# Altium schematic sheet Peripherals_Sheet.SchDoc
size A4; SheetNumber: 2; SheetTotal: 2
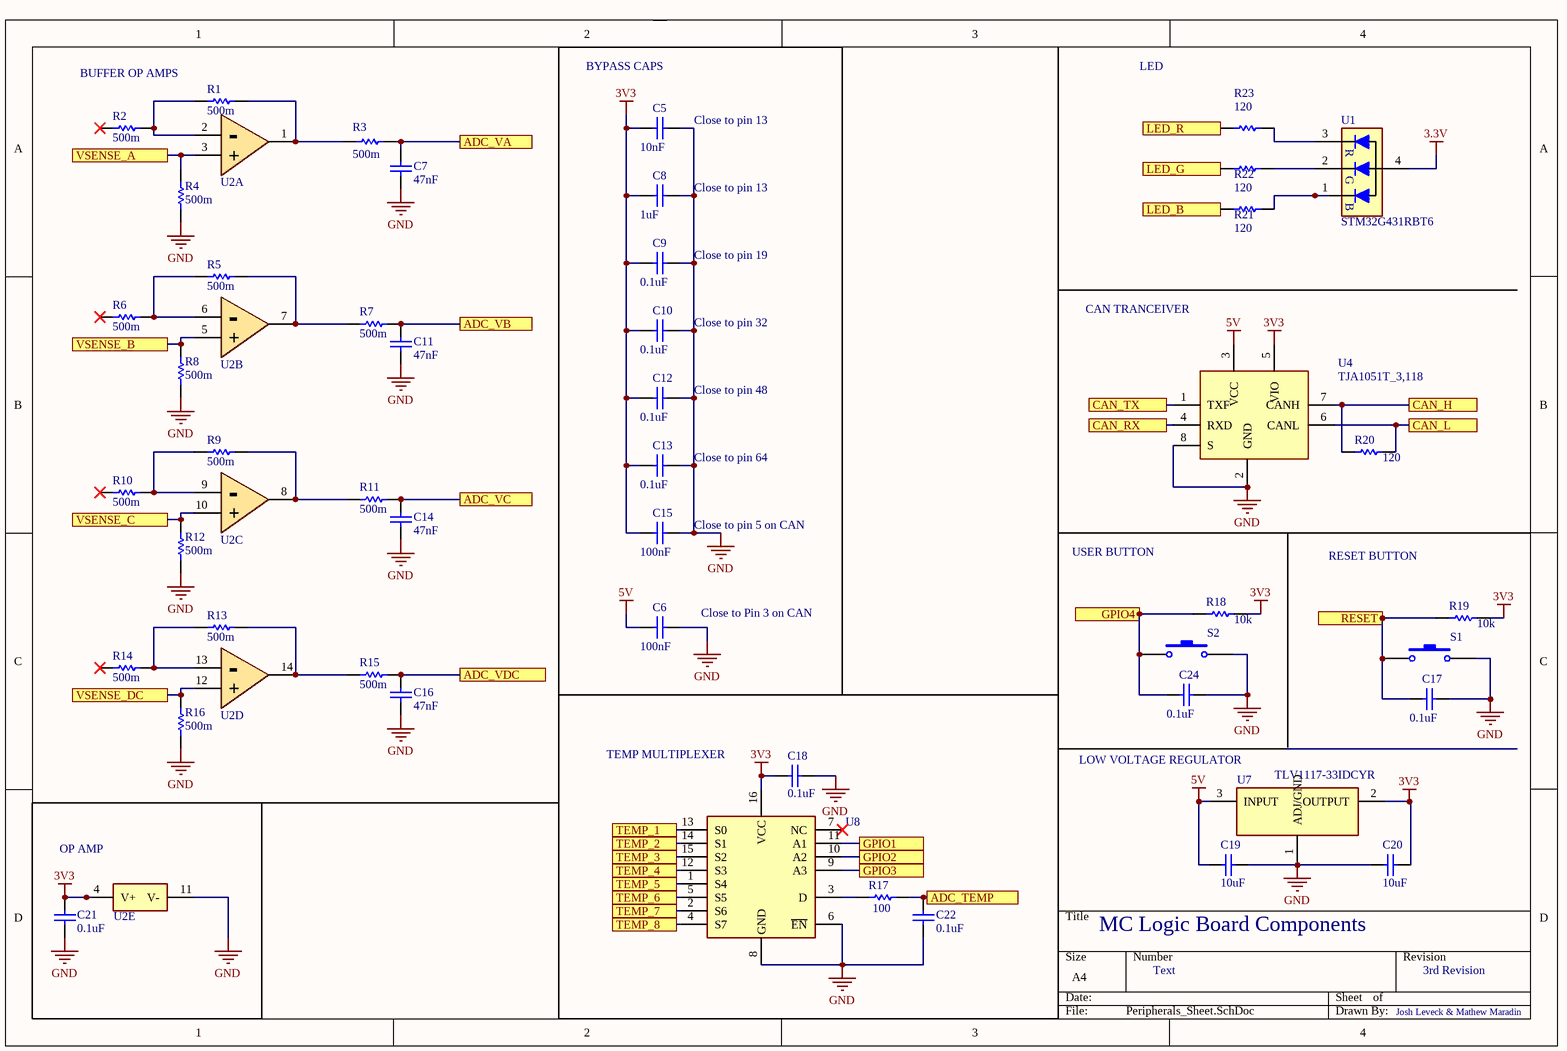
[diagram p0: Peripherals_Sheet.SchDoc]

## Parts
C5  value 10nF  [0805 - Capacitor]  (hidden comment: 10V)
C6  value 100nF  [0805 - Capacitor]  (hidden comment: Capacitor - Nonpolarized)
C7  value 47nF  [0805 - Capacitor]  (hidden comment: Capacitor - Nonpolarized)
C8  value 1uF  [0805 - Capacitor]  (hidden comment: 100V)
C9  value 0.1uF  [0805 - Capacitor]  (hidden comment: 100V)
C10  value 0.1uF  [0805 - Capacitor]  (hidden comment: 100V)
C11  value 47nF  [0805 - Capacitor]  (hidden comment: Capacitor - Nonpolarized)
C12  value 0.1uF  [0805 - Capacitor]  (hidden comment: 100V)
C13  value 0.1uF  [0805 - Capacitor]  (hidden comment: 100V)
C14  value 47nF  [0805 - Capacitor]  (hidden comment: Capacitor - Nonpolarized)
C15  value 100nF  [0805 - Capacitor]  (hidden comment: Capacitor - Nonpolarized)
C16  value 47nF  [0805 - Capacitor]  (hidden comment: Capacitor - Nonpolarized)
C17  value 0.1uF  [0805 - Capacitor]  (hidden comment: 100V)
C18  value 0.1uF  [0805 - Capacitor]  (hidden comment: Capacitor - Nonpolarized)
C19  value 10uF  [0805 - Capacitor]  (hidden comment: Capacitor - Nonpolarized)
C20  value 10uF  [0805 - Capacitor]  (hidden comment: Capacitor - Nonpolarized)
C21  value 0.1uF  [0805 - Capacitor]  (hidden comment: Capacitor - Nonpolarized)
C22  value 0.1uF  [0805 - Capacitor]  (hidden comment: Capacitor - Nonpolarized)
C24  value 0.1uF  [0805 - Capacitor]  (hidden comment: 100V)
R1  value 500m  [0603 - Resistor]  (hidden comment: Resistor)
R2  value 500m  [0603 - Resistor]  (hidden comment: Resistor)
R3  value 500m  [0603 - Resistor]  (hidden comment: Resistor)
R4  value 500m  [0603 - Resistor]  (hidden comment: Resistor)
R5  value 500m  [0603 - Resistor]  (hidden comment: Resistor)
R6  value 500m  [0603 - Resistor]  (hidden comment: Resistor)
R7  value 500m  [0603 - Resistor]  (hidden comment: Resistor)
R8  value 500m  [0603 - Resistor]  (hidden comment: Resistor)
R9  value 500m  [0603 - Resistor]  (hidden comment: Resistor)
R10  value 500m  [0603 - Resistor]  (hidden comment: Resistor)
R11  value 500m  [0603 - Resistor]  (hidden comment: Resistor)
R12  value 500m  [0603 - Resistor]  (hidden comment: Resistor)
R13  value 500m  [0603 - Resistor]  (hidden comment: Resistor)
R14  value 500m  [0603 - Resistor]  (hidden comment: Resistor)
R15  value 500m  [0603 - Resistor]  (hidden comment: Resistor)
R16  value 500m  [0603 - Resistor]  (hidden comment: Resistor)
R17  value 100  [0603 - Resistor]  (hidden comment: Resistor)
R18  10k  [0603 - Resistor]
R19  10k  [0603 - Resistor]
R20  value 120  [0603 - Resistor]  (hidden comment: 10k)
R21  value 120  [0603 - Resistor]  (hidden comment: 10k)
R22  value 120  [0603 - Resistor]  (hidden comment: 10k)
R23  value 120  [0603 - Resistor]  (hidden comment: 10k)
S1  Switch - Push Button  [6x6mm Switch]  (value not drawn)
S2  Switch - Push Button  [6x6mm Switch]  (value not drawn)
U1  STM32G431RBT6  [LQFP64-10x10mm]
U2  LM324AMX/NOPB  [LM324AMX/NOPB]  (value not drawn)  (parts A,B,C,D,E of 5)
U4  TJA1051T_3,118  [TJA1051T/3,118]
U7  TLV1117-33IDCYR  [TLV1117]
U8  NX3L4051PW,118  [SOP65P640X120-16N]  (value not drawn)

## Blocks framed on the sheet
OP AMP: C21 U2

## Ports
ADC_TEMP, ADC_VA, ADC_VB, ADC_VC, ADC_VDC, CAN_H, CAN_L, CAN_RX, CAN_TX, GPIO1, GPIO2, GPIO3, GPIO4, LED_B, LED_G, LED_R, RESET, TEMP_1, TEMP_2, TEMP_3, TEMP_4, TEMP_5, TEMP_6, TEMP_7, TEMP_8, VSENSE_A, VSENSE_B, VSENSE_C, VSENSE_DC

## Nets
3.3V: U1.4
3V3: C5.1 C8.1 C9.1 C10.1 C12.1 C13.1 C15.2 C18.1 C20.2 C21.1 R18.1 R19.1 U2.4(V+) U4.5(VIO) U7.2(OUTPUT) U8.16(VCC)
5V: C6.2 C19.2 U4.3(VCC) U7.3(INPUT)
GND: C5.2 C6.1 C7.1 C8.2 C9.2 C10.2 C11.1 C12.2 C13.2 C14.1 C15.1 C16.1 C17.2 C18.2 C19.1 C20.1 C21.2 C22.1 C24.2 R4.1 R8.1 R12.1 R16.1 S1.2 S2.2 U2.11(V-) U4.2(GND) U4.8(S) U7.1(ADJ/GND) U8.6(~{EN}) U8.8(GND)
ADC_TEMP: C22.2 R17.1 ; port ADC_TEMP
ADC_VA: C7.2 R3.2 ; port ADC_VA
ADC_VB: C11.2 R7.2 ; port ADC_VB
ADC_VC: C14.2 R11.2 ; port ADC_VC
ADC_VDC: C16.2 R15.2 ; port ADC_VDC
CAN_H: R20.2 U4.7(CANH) ; port CAN_H
CAN_L: R20.1 U4.6(CANL) ; port CAN_L
CAN_RX: U4.4(RXD) ; port CAN_RX
CAN_TX: U4.1(TXF) ; port CAN_TX
GPIO1: U8.11(A1) ; port GPIO1
GPIO2: U8.10(A2) ; port GPIO2
GPIO3: U8.9(A3) ; port GPIO3
GPIO4: C24.1 R18.2 S2.1 ; port GPIO4
LED_B: R21.2 ; port LED_B
LED_G: R22.2 ; port LED_G
LED_R: R23.2 ; port LED_R
RESET: C17.1 R19.2 S1.1 ; port RESET
TEMP_1: U8.13(S0) ; port TEMP_1
TEMP_2: U8.14(S1) ; port TEMP_2
TEMP_3: U8.15(S2) ; port TEMP_3
TEMP_4: U8.12(S3) ; port TEMP_4
TEMP_5: U8.1(S4) ; port TEMP_5
TEMP_6: U8.5(S5) ; port TEMP_6
TEMP_7: U8.2(S6) ; port TEMP_7
TEMP_8: U8.4(S7) ; port TEMP_8
VSENSE_A: R4.2 U2.3(+) ; port VSENSE_A
VSENSE_B: R8.2 U2.5(+) ; port VSENSE_B
VSENSE_C: R12.2 U2.10(+) ; port VSENSE_C
VSENSE_DC: R16.2 U2.12(+) ; port VSENSE_DC
NetR1_1: R1.1 R2.2 U2.2(-)
NetR1_2: R1.2 R3.1 U2.1
NetR5_1: R5.1 R6.2 U2.6(-)
NetR5_2: R5.2 R7.1 U2.7
NetR9_1: R9.1 R10.2 U2.9(-)
NetR9_2: R9.2 R11.1 U2.8
NetR13_1: R13.1 R14.2 U2.13(-)
NetR13_2: R13.2 R15.1 U2.14
NetR17_2: R17.2 U8.3(D)
NetR21_1: R21.1 U1.1
NetR22_1: R22.1 U1.2
NetR23_1: R23.1 U1.3

Not connected (* = marked no-connect by the designer): R2 1*; R6 1*; R10 1*; R14 1*; U8 7(NC)*

## Notes on the sheet
- BUFFER OP AMPS
- BYPASS CAPS
- (near C5) Close to pin 13
- LED
- (near C8) Close to pin 13
- (near C9) Close to pin 19
- (near C10) Close to pin 32
- CAN TRANCEIVER
- (near C12) Close to pin 48
- (near C13) Close to pin 64
- (near C15) Close to pin 5 on CAN
- USER BUTTON
- RESET BUTTON
- (near C6) Close to Pin 3 on CAN
- TEMP MULTIPLEXER
- LOW VOLTAGE REGULATOR
- MC Logic Board Components
- Text
- 3rd Revision
- Josh Leveck & Mathew Maradin
- (in symbol RGB LED- Common Anode) R; G; B

## Library data of the parts
C5-C22 C24 = Capacitor - Nonpolarized: Nonpolarized Capacitor; Supplier: *; Manufacturer: *; Rating: *; Manufacturer Part Number: *
  C5: Supplier Part Number: 311-1475-1-ND
  C6 C15: Supplier Part Number: 311-3420-1-ND
  C7 C11 C14 C16: Supplier Part Number: 311-1431-1-ND
  C8: Supplier Part Number: 311-1456-1-ND
  C9 C10 C12 C13 C17 C18 C21 C22 C24: Supplier Part Number: 311-1141-1-ND
  C19 C20: Supplier Part Number: 13-CC0805KFX7R6BB106CT-ND
R18-R23 = Resistor: Rating: *; Manufacturer Part Number: *; Manufacturer: *; Supplier Part Number: 311-10.0KHRCT-ND; Supplier: *
  R18 R19: Value: 10k
S1 S2 = Switch - Push Button: Push Button Switch; Supplier: *; Manufacturer Part Number: *; Manufacturer: *; Supplier Part Number: *; Rating: *; Value: *
U1 = RGB LED- Common Anode: Manufacturer Part Number: *; Manufacturer: *; Supplier Part Number: *; Supplier: *
U2 = LM324AMX/NOPB: Gen Purp 4Ch Opamp; Manufacturer: TI; Manufacturer Part Number: LM324AMX/NOPB; Supplier Part Number: LM324AMX/NOPBCT-ND; Supplier: Digikey; ComponentLink1Description: Datasheet; ComponentLink1URL: https://www.ti.com/lit/ds/symlink/lm124-n.pdf?HQS=dis-dk-null-digikeymode-dsf-pf-null-wwe&ts=1616555832552
U4 = TJA1051T_3,118: CAN Transceiver IC 4.5V-5.5V 250ns; Manufacturer: NXP; Manufacturer Part Number: TJA1051T/3,118; Supplier Part Number: 568-8684-1-ND; Supplier: Digikey; ComponentLink1Description: Datasheet; ComponentLink1URL: http://www.nxp.com/docs/en/data-sheet/TJA1051.pdf
U7 = TLV1117-33IDCYR: Linear Voltage Regulator IC 3.3V 800MA SOT223-4; Manufacturer: Texas Instruments; Manufacturer Part Number: TLV1117-33IDCYR; Supplier Part Number: 296-21112-1-ND; Supplier: Digikey; ComponentLink1Description: Datasheet; ComponentLink1URL: http://www.ti.com/lit/ds/symlink/tlv1117.pdf?HQS=TI-null-null-digikeymode-df-pf-null-wwe&ts=1590668900314
U8 = NX3L4051PW,118: 8:1 MUX; Manufacturer: NXP; Manufacturer Part Number: NX3L4051PW,118; Supplier Part Number: 568-12393-1-ND; Supplier: Digikey; ComponentLink1Description: Datsheet; ComponentLink1URL: https://www.nxp.com/docs/en/data-sheet/NX3L4051.pdf
R1-R17 = Resistor: Rating: *; Manufacturer Part Number: *; Manufacturer: *; Supplier: *
  R1-R16: Supplier Part Number: 13-RL0603JR-070R5LCT-ND
  R17: Supplier Part Number: 311-100HRCT-ND